# EasyEDA Pro project JLCEDA_AT_START_F457_V1.0.epro, board AT-START-F457 V1.0
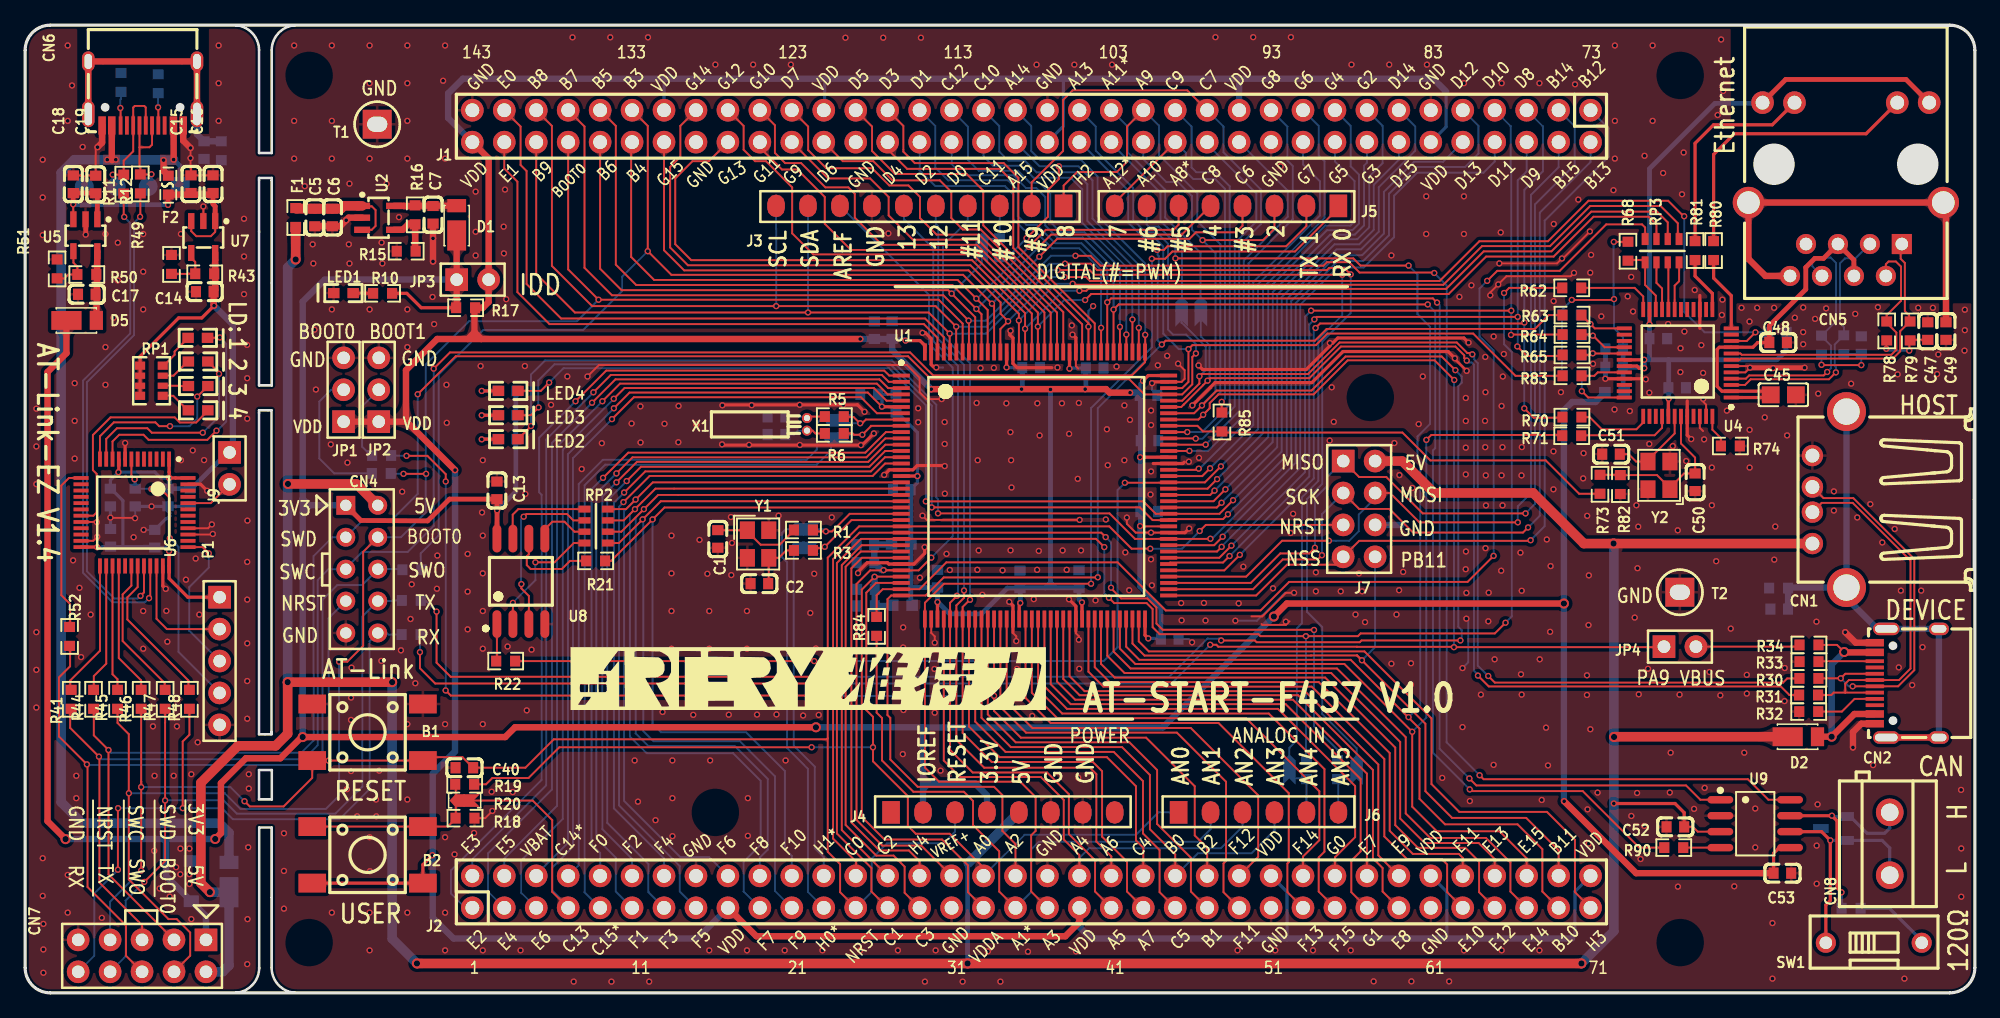
[diagram p5: board, top side]
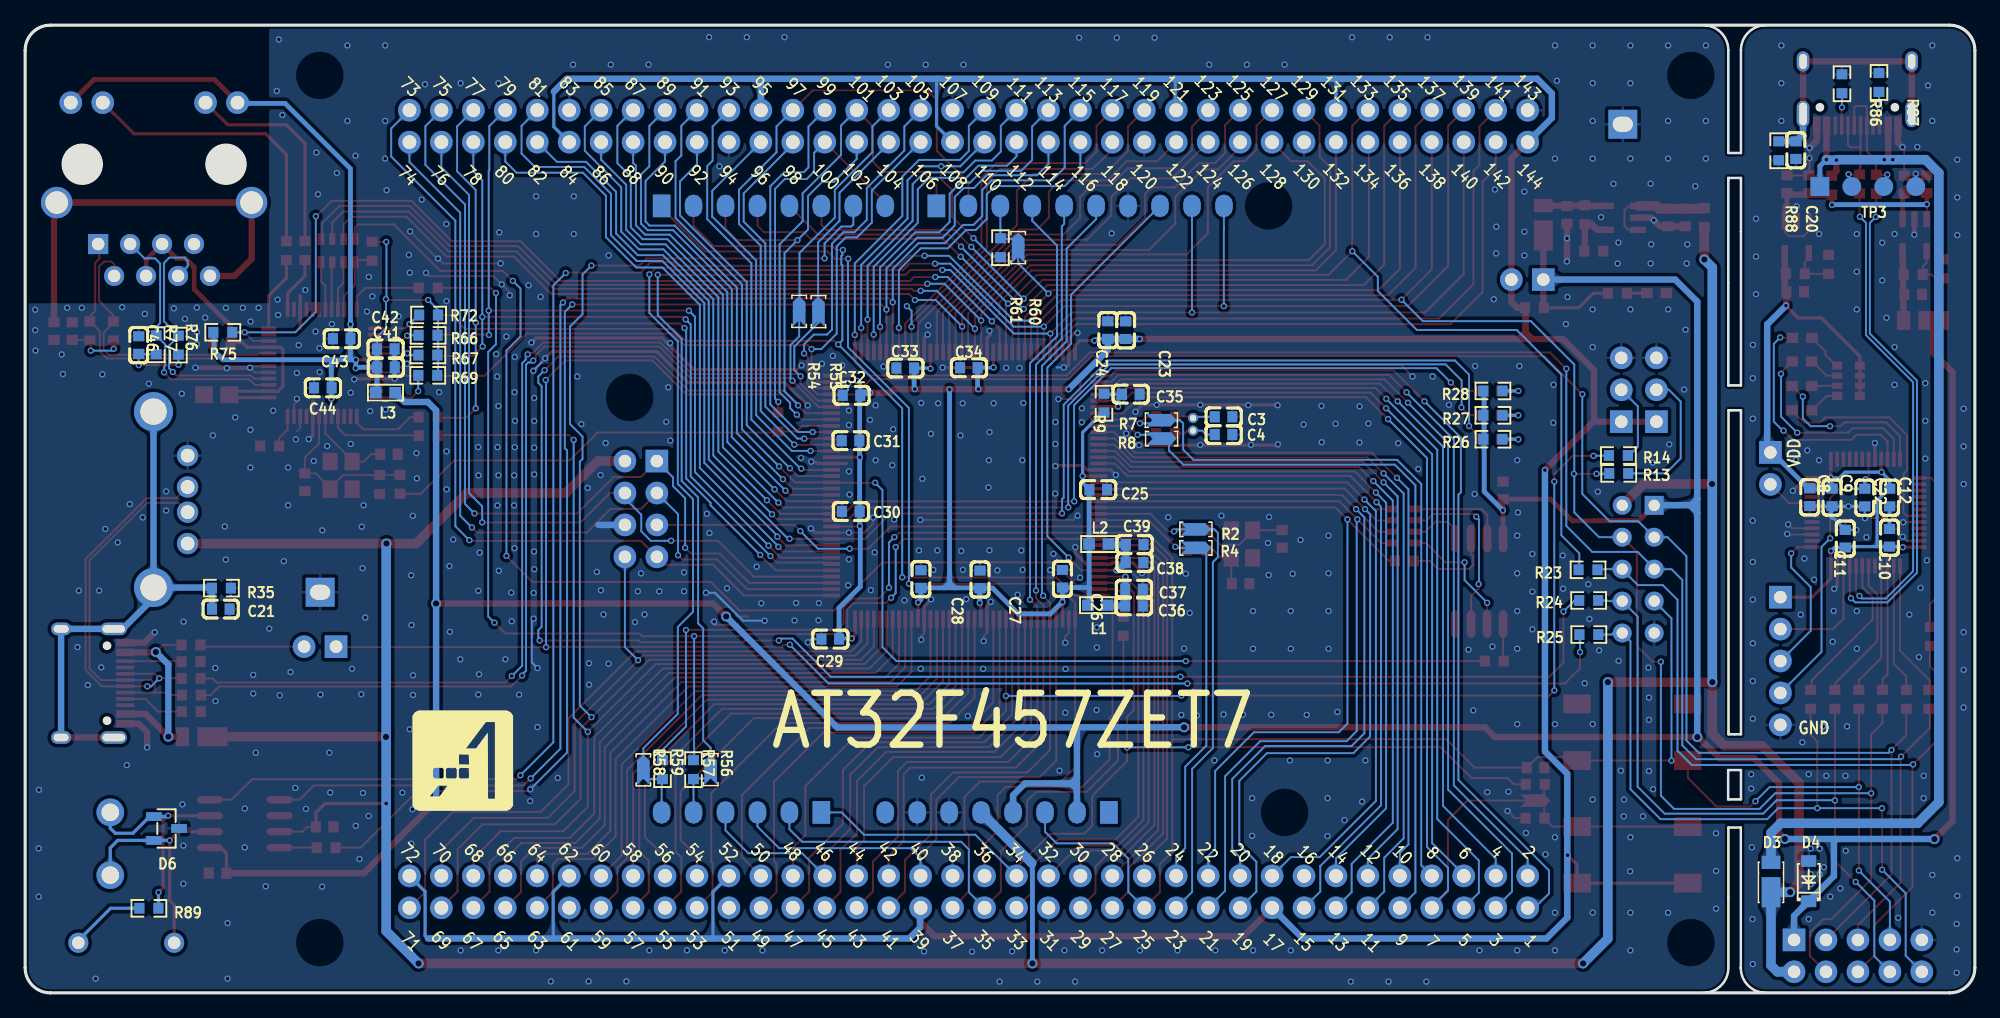
[diagram p6: board, bottom side, seen from below]

Outline 155 x 77 mm; copper layers: Top Layer, Bottom Layer. Coordinates in mm from the lower left corner of the outline.
Outline path: 16.6,77 arc(18.01,76.42) 18.6,75 18.6,66.83 19.6,66.83 19.6,75 arc(20.19,76.42) 21.6,77 ; 18.6,48.36 18.6,60.58 18.6,64.67 18.59,64.85 19.6,64.85 19.6,64.67 19.6,56.51 19.6,48.34 ; 18.6,48.36 18.62,48.34 ; 18.6,48.36 arc(18.6,48.34) 18.62,48.34 ; 18.62,48.34 19.59,48.34 ; 16.61,0 arc(18.02,0.59) 18.61,2 18.61,13.16 19.59,13.16 19.59,2 arc(20.18,0.59) 21.59,0 ; 19.59,48.34 19.6,48.34 ; 19.59,48.34 arc(19.6,48.34) 19.6,48.34 ; 0,75 0,2 arc(0.59,0.59) 2,0 153,0 arc(154.41,0.59) 155,2 155,75 arc(154.41,76.41) 153,77 2,77 arc(0.59,76.41) 0,75 ; 18.59,46.36 18.59,20.57 19.58,20.57 19.58,46.36 18.59,46.36 ; 18.59,17.73 18.59,15.39 19.61,15.39 19.61,17.73 18.59,17.73
Stack: Top Layer 0.035mm / Dielectric1 1.51mm FR4 er 4.5 / Bottom Layer 0.035mm

## Design rules (mm)
template: 自定义配置
spacing copperThickness1oz (default): track to track 0.152, other pairs 0.152 to 0.3
track width copperThickness1oz (default): min 0.152, default 0.152, max 2.54
differential pair differentialPair (default): width min 0.127, default 0.254, max 2.54; gap min 0.152, default 0.152
via viaSize (default): diameter min 0.5, default 0.5, max 0.8; hole min 0.3, default 0.3, max 0.5

## Placement (name value [footprint] x y rotation side)
B1  贴片按键6*6*5 黑色  [SW-SMD_4P-L6.0-W6.0-P4.50-LS9.0]  27.22 20.74 180 top
B2  贴片按键6*6*5 红色  [SW-SMD_4P-L6.0-W6.0-P4.50-LS9.0]  27.22 10.98 180 top
C1  15pF  [C0603]  55.07 36.12 90 top
C2  15pF  [C0603]  58.37 32.56 0 top
C3  18pF  [C0603]  59.73 45.84 0 bottom
C4  18pF  [C0603]  59.73 44.42 0 bottom
C5  10uF  [C0603]  23.03 61.7 270 top
C6  100nF  [C0603]  24.43 61.7 270 top
C7  10uF  [C0603]  32.43 61.91 270 top
C8  4.7uF  [C0603]  13.13 39.44 90 bottom
C9  100nF  [C0603]  11.35 39.42 90 bottom
C10  100nF  [C0603]  6.79 36.21 270 bottom
C11  100nF  [C0603]  10.3 36.14 270 bottom
C12  100nF  [C0603]  6.78 39.41 90 bottom
C13  100nF  [C0603]  37.51 39.99 90 top
C14  10uF  [C0603]  14.28 55.79 0 top
C15  10uF  [C0603]  13.18 64.35 270 top
C16  100nF  [C0603]  14.93 64.35 270 top
C17  10uF  [C0603]  4.9 55.59 0 top
C18  10uF  [C0603]  3.83 64.34 270 top
C19  100nF  [C0603]  5.61 64.32 270 top
C20  100nF  [C0603]  14.22 67.06 90 bottom
C21  100nF  [C0603]  139.45 30.54 180 bottom
C22  100nF  [C0603]  8.75 39.41 90 bottom
C23  4.7uF  [C0603]  67.51 52.73 90 bottom
C24  100nF  [C0603]  68.93 52.74 90 bottom
C25  100nF  [C0603]  69.69 40.04 180 bottom
C26  100nF  [C0603]  72.53 32.95 90 bottom
C27  100nF  [C0603]  79.09 32.9 90 bottom
C28  100nF  [C0603]  83.79 32.93 90 bottom
C29  100nF  [C0603]  90.99 28.15 0 bottom
C30  100nF  [C0603]  89.36 38.3 0 bottom
C31  100nF  [C0603]  89.38 43.94 0 bottom
C32  100nF  [C0603]  89.31 47.55 0 bottom
C33  100nF  [C0603]  85.03 49.72 0 bottom
C34  100nF  [C0603]  79.98 49.74 0 bottom
C35  100nF  [C0603]  67.1 47.63 180 bottom
C36  1uF  [C0603]  66.84 30.79 180 bottom
C37  100nF  [C0603]  66.84 32.11 180 bottom
C38  100nF  [C0603]  66.8 34.24 180 bottom
C39  1uF  [C0603]  66.79 35.67 180 bottom
C40  100nF  [C0603]  34.92 17.92 180 top
C41  10uF  [C0603]  126.32 49.78 180 bottom
C42  100nF  [C0603]  126.33 51.24 180 bottom
C43  100nF  [C0603]  129.84 52.05 0 bottom
C44  100nF  [C0603]  131.33 48.14 0 bottom
C45  47uF  [C0805]  139.77 47.59 180 top
C46  100nF  [C0603]  145.97 51.55 90 bottom
C47  100nF  [C0603]  151.26 52.66 90 top
C48  100nF  [C0603]  139.36 51.75 180 top
C49  100nF  [C0603]  152.71 52.66 90 top
C50  15pF  [C0603]  132.76 40.63 270 top
C51  15pF  [C0603]  126.08 42.86 180 top
C52  100nF  [C0603]  131.19 13.21 0 top
C53  100nF  [C0603]  139.7 9.53 180 top
CN1  JTJ-USB-AF-08  [USB-A-TH__USB-AF-90]  143.44 39.25 90 top
CN2  -  [USB-C-SMD_TYPEC-304-BCP16]  149.59 24.64 90 top
CN4  CON10A_0  [HDR2X5#2]  25.49 38.8 270 top
CN5  RJ45(TRJ201)  [RJ45-TH_HR911105A]  144.75 63.94 180 top
CN6  -  [USB-C-SMD_TYPEC-304-BCP16]  9.34 71.57 180 top
CN7  CON10  [HDR2X5]  14.37 4.22 180 top
CN8  KF301-5.0-2P  [CONN-TH_P5.00_KF301-5.0-2P]  148.23 11.87 90 top
D1  DFLS130L-7  [POWERDI-123_L2.8-W1.8-LS3.7-RD]  34.31 61.45 90 top
D2  DFLS130L-7  [POWERDI-123_L2.8-W1.8-LS3.7-RD]  141.3 20.38 0 top
D3  DFLS130L-7  [POWERDI-123_L2.8-W1.8-LS3.7-RD]  16.21 9.19 90 bottom
D4  SMF3.3A  [SOD-123FL_L2.8-W1.8-LS3.8-RD]  13.21 8.89 90 bottom
D5  DFLS130L-7  [POWERDI-123_L2.8-W1.8-LS3.7-RD]  4.47 53.5 0 top
D6  PESD2CANFD24V-TR  [SOT-23-3_L2.9-W1.3-P1.90-LS2.4-BR]  143.76 13.08 0 bottom
F1  SMD0603B050TF  [R0603]  21.51 61.7 90 top
F2  BSMD0603-050-6V  [F0603]  11.38 64.27 270 top
J1  HDR 2X36  [HDR_2.54_2X36]  80 68.96 180 top
J2  HDR 2X36  [HDR_2.54_2X36]  80 8.04 0 top
J3  CON10  [FEMALE HEADER 1X10]  71.13 62.62 0 top
J4  CON8  [FEMALE HEADER 1X8]  77.73 14.36 0 top
J5  CON8  [FEMALE HEADER 1X8]  95.51 62.62 180 top
J6  CON6  [FEMALE HEADER 1X6]  98.05 14.36 0 top
J7  Header 4X2  [HDR2X4]  104.78 42.31 270 top
J9  1X2P_2.54M  [HDR1X2]  16.25 43 270 top
JP1  Jumper 1x3P  [HEADER 1X3]  25.31 45.45 90 top
JP2  Jumper 1x3P  [HEADER 1X3]  28.11 45.45 90 top
JP3  Jumper 1x2P  [HEADER 1X2]  34.31 56.75 0 top
JP4  Jumper 1x2P  [HEADER 1X2]  130.28 27.55 0 top
L1  0.5A,600Ω@100Mhz  [0603_L]  69.74 30.84 180 bottom
L2  0.5A,600Ω@100Mhz  [0603_L]  69.65 35.71 180 bottom
L3  0.5A,600Ω@100Mhz  [0603_L]  126.36 47.76 0 bottom
LD1  RED  [LED0603]  12.95 52.12 0 top
LD2  GREEN  [LED0603]  12.98 50.23 0 top
LD3  BLUE  [LED0603]  12.98 48.28 0 top
LD4  YELLOW  [LED0603]  12.98 46.35 0 top
LED1  RED  [LED0603]  26.08 55.69 180 top
LED2  RED  [LED0603]  37.63 44.05 0 top
LED3  YELLOW  [LED0603]  37.63 45.96 0 top
LED4  GREEN  [LED0603]  37.63 47.9 0 top
P1  Header 5  [HDR1X5]  15.46 31.48 270 top
R1  0Ω  [R0603]  61.87 36.83 0 top
R2  NC  [SB-PAD]  61.93 36.88 0 bottom
R3  0Ω  [R0603]  61.87 35.2 0 top
R4  NC  [SB-PAD]  61.93 35.41 0 bottom
R5  0Ω  [R0603]  64.33 45.86 0 top
R6  0Ω  [R0603]  64.33 44.52 0 top
R7  NC  [SB-PAD]  64.67 45.57 0 bottom
R8  NC  [SB-PAD]  64.65 44.1 0 bottom
R9  0Ω  [R0603]  69.23 46.92 270 bottom
R10  1kΩ  [R0603]  28.41 55.66 180 top
R11  0Ω  [R0603]  7.84 64.35 270 top
R12  0Ω  [R0603]  9.16 64.37 270 top
R13  10kΩ  [R0603]  28.31 41.33 0 bottom
R14  10kΩ  [R0603]  28.34 42.76 0 bottom
R15  15kΩ  [R0603]  30.29 59.01 180 top
R16  51kΩ  [R0603]  31 61.91 90 top
R17  0Ω  [R0603]  35.02 54.52 0 top
R18  100kΩ  [R0603]  34.97 13.9 180 top
R19  0Ω  [R0603]  34.94 16.59 0 top
R20  NC  [SB-PAD]  34.94 15.3 0 top
R21  33Ω  [R0603]  45.35 34.37 180 top
R22  33Ω  [R0603]  38.2 26.4 180 top
R23  470Ω  [R0603]  30.75 33.66 0 bottom
R24  470Ω  [R0603]  30.7 31.23 0 bottom
R25  470Ω  [R0603]  30.69 28.51 0 bottom
R26  1kΩ  [R0603]  38.31 44.05 180 bottom
R27  1kΩ  [R0603]  38.31 45.96 180 bottom
R28  1kΩ  [R0603]  38.31 47.9 180 bottom
R30  0Ω  [R0603]  141.81 25.02 0 top
R31  0Ω  [R0603]  141.78 23.7 0 top
R32  5.1kΩ  [R0603]  141.79 22.38 0 top
R33  5.1kΩ  [R0603]  141.81 26.36 0 top
R34  10kΩ  [R0603]  141.81 27.69 0 top
R35  1MΩ  [R0603]  139.4 32.21 0 bottom
R41  33Ω  [R0603]  3.66 23.36 270 top
R43  47kΩ  [R0603]  14.27 57.22 180 top
R44  33Ω  [R0603]  5.44 23.36 270 top
R45  33Ω  [R0603]  7.34 23.36 270 top
R46  33Ω  [R0603]  9.22 23.36 270 top
R47  33Ω  [R0603]  11.13 23.36 270 top
R48  33Ω  [R0603]  13.06 23.36 270 top
R49  15kΩ  [R0603]  11.63 57.96 90 top
R50  51kΩ  [R0603]  4.9 57.16 180 top
R51  15kΩ  [R0603]  2.54 57.61 90 top
R52  33Ω  [R0603]  3.53 28.36 270 top
R54  NC  [SB-PAD]  93.47 54.23 270 bottom
R55  NC  [SB-PAD]  91.93 54.21 270 bottom
R56  NC  [SB-PAD]  100.5 17.76 270 bottom
R57  0Ω  [R0603]  101.87 17.76 270 bottom
R58  NC  [SB-PAD]  105.85 17.74 270 bottom
R59  0Ω  [R0603]  104.33 17.76 270 bottom
R60  NC  [SB-PAD]  76.06 59.3 270 bottom
R61  0Ω  [R0603]  77.46 59.29 90 bottom
R62  33Ω  [R0603]  122.95 56.09 0 top
R63  33Ω  [R0603]  122.97 53.93 0 top
R64  33Ω  [R0603]  122.97 52.38 0 top
R65  33Ω  [R0603]  122.97 50.76 0 top
R66  4.7kΩ  [R0603]  122.97 52.32 0 bottom
R67  4.7kΩ  [R0603]  122.98 50.75 0 bottom
R68  4.7kΩ  [R0603]  127.42 59.01 270 top
R69  4.7kΩ  [R0603]  122.99 49.14 0 bottom
R70  33Ω  [R0603]  122.97 45.81 0 top
R71  33Ω  [R0603]  122.95 44.33 0 top
R72  1.5kΩ  [R0603]  122.92 53.94 180 bottom
R73  33Ω(NC)  [R0603]  125.2 40.47 90 top
R74  6.8kΩ  [R0603]  135.56 43.52 180 top
R75  4.7kΩ  [R0603]  139.29 52.56 0 bottom
R76  49.9Ω  [R0603]  142.81 51.55 90 bottom
R77  49.9Ω  [R0603]  144.58 51.57 90 bottom
R78  49.9Ω  [R0603]  147.99 52.67 90 top
R79  49.9Ω  [R0603]  149.85 52.67 90 top
R80  470Ω  [R0603]  134.23 59.06 270 top
R81  470Ω  [R0603]  132.76 59.06 270 top
R82  100kΩ(NC)  [R0603]  126.82 40.45 270 top
R83  33Ω  [R0603]  122.97 49.1 0 top
R84  0Ω  [R0603]  67.69 29.16 90 top
R85  0Ω  [R0603]  95.14 45.42 270 top
R86  5.1kΩ  [R0603]  10.57 72.34 90 bottom
R87  5.1kΩ  [R0603]  7.62 72.44 90 bottom
R88  1MΩ  [R0603]  15.6 67 270 bottom
R89  120Ω  [R0603]  145.16 6.73 180 bottom
R90  330Ω  [R0603]  131.06 11.56 0 top
RP1  1kΩ  [RES-ARRAY-SMD_0603-8P-L3.2-W1.6-BL]  10.04 48.71 270 top
RP2  33R  [0603*4,8P4R]  46.32 35.79 90 top
RP3  33R  [0603*4,8P4R]  131.49 59.98 180 top
SW1  DSWB01LHGET  [SW-TH_DSWB01LHGET]  146.96 3.99 90 top
T1  TESTPOINT TP-5006  [TESTHOOK]  27.99 69.12 0 top
T2  TESTPOINT TP-5006  [TESTHOOK]  131.55 31.88 0 top
TP3  1X4P_2.54F  [HDR1X4 - TOP]  12.32 64.16 0 bottom
U1  AT32F457ZET7  [LQFP144_20*20]  80.28 40.37 0 top
U2  RT9080N-08GJ5  [SOT-23-5]  28.44 60.08 0 top
U4  DM9162EP  [LQFP48_7*7]  131.38 50.12 180 top
U5  RT9080N-08GJ5  [SOT-23-5]  3.2 59.9 270 top
U6  AT32F403ACCT7  [LQFP48 - 2]  11.45 42.47 270 top
U7  RT9080N-08GJ5  [SOT-23-5]  12.57 59.76 270 top
U8  EN25QH128A-104HIP  [SOIC-8_208MIL]  39.41 32.75 0 top
U9  MCP2562FD-E/SN  [SOIC-8_L4.9-W3.9-P1.27-LS6.0-BL]  137.54 13.46 270 top
X1  32.768kHz  [OSC-TH_BD2.0-P0.70-D0.3]  62.15 45.24 0 top
Y1  8MHz  [CRYSTAL-SMD_4P-L3.2-W2.5-BL]  58.27 35.71 270 top
Y2  25MHz  [OSC-SMD_4P-L3.2-W2.5-BL]  129.89 41.18 90 top

## Footprints (pads in the part's own frame, mm; a bottom-side part is the same pattern mirrored in y, then rotated)
0603*4,8P4R
  rect 0.55x0.95 smd: 1(0,0) 4(2.7,0) 5(2.7,1.85) 8(0,1.85)
  rect 0.5x0.95 smd: 2(0.9,0) 3(1.8,0) 6(1.8,1.85) 7(0.9,1.85)
0603_L
  rect 0.93x0.9 smd: 1(-0.77,0) 2(0.77,0)
C0603
  rect 0.8x0.9 smd: 1(-0.7,0) 2(0.7,0)
C0805
  rect 1.41x1.35 smd: 1(-1,0) 2(1,0)
CONN-TH_P5.00_KF301-5.0-2P
  round 2.2 hole 1.4: 1(-2.5,0) 2(2.5,0)
CRYSTAL-SMD_4P-L3.2-W2.5-BL
  rect 1.4x1.2 smd: 1(-1.1,-0.85) 2(1.1,-0.85) 3(1.1,0.85) 4(-1.1,0.85)
F0603
  rect 0.806x0.864 smd: 1(-0.753,0) 2(0.753,0)
FEMALE HEADER 1X6
  custom 1.4x1.8 hole 0.7x1: 1(-6.35,0) 2(-3.81,0) 3(-1.27,0) 4(1.27,0) 5(3.81,0) 6(6.35,0)
FEMALE HEADER 1X8
  custom 1.4x1.8 hole 0.7x1: 1(-8.89,0) 2(-6.35,0) 3(-3.81,0) 4(-1.27,0) 5(1.27,0) 6(3.81,0) 7(6.35,0) 8(8.89,0)
FEMALE HEADER 1X10
  custom 1.4x1.8 hole 0.7x1: 1(11.43,0) 2(8.89,0) 3(6.35,0) 4(3.81,0) 5(1.27,0) 6(-1.27,0) 7(-3.81,0) 8(-6.35,0) 9(-8.89,0) 10(-11.43,0)
HDR1X2
  rect 1.8x1.8 hole 1: 1(0,0)
  round 1.8 hole 1: 2(2.54,0)
HDR1X4 - TOP
  rect 1.5x1.5 smd: 1(0,0)
  round 1.5 smd: 2(-2.54,0) 3(-5.08,0) 4(-7.62,0)
HDR1X5
  rect 1.8x1.8 hole 1: 1(0,0)
  round 1.8 hole 1: 2(2.54,0) 3(5.08,0) 4(7.62,0) 5(10.16,0)
HDR2X4
  rect 1.8x1.8 hole 1.005x1: 1(0,0)
  round 1.8 hole 1.005x1: 2(0,2.54) 3(2.54,0) 4(2.54,2.54) 5(5.08,0) 6(5.08,2.54) 7(7.62,0) 8(7.62,2.54)
HDR2X5
  rect 1.8x1.8 hole 1: 1(0,0)
  round 1.8 hole 1: 2(0,2.54) 3(2.54,0) 4(2.54,2.54) 5(5.08,0) 6(5.08,2.54) 7(7.62,0) 8(7.62,2.54) 9(10.16,0) 10(10.16,2.54)
HDR2X5#2
  rect 1.5x1.5 hole 0.9: 1(0,0)
  round 1.5 hole 0.9: 2(0,2.54) 3(2.54,0) 4(2.54,2.54) 5(5.08,0) 6(5.08,2.54) 7(7.62,0) 8(7.62,2.54) 9(10.16,0) 10(10.16,2.54)
HDR_2.54_2X36
  round 1.8 hole 1.1: 1(-44.45,-1.27) 2(-44.45,1.27) 3(-41.91,-1.27) 4(-41.91,1.27) 5(-39.37,-1.27) 6(-39.37,1.27) 7(-36.83,-1.27) 8(-36.83,1.27) 9(-34.29,-1.27) 10(-34.29,1.27) 11(-31.75,-1.27) 12(-31.75,1.27) 13(-29.21,-1.27) 14(-29.21,1.27) 15(-26.67,-1.27) 16(-26.67,1.27) 17(-24.13,-1.27) 18(-24.13,1.27) 19(-21.59,-1.27) 20(-21.59,1.27) 21(-19.05,-1.27) 22(-19.05,1.27) 23(-16.51,-1.27) 24(-16.51,1.27) 25(-13.97,-1.27) 26(-13.97,1.27) 27(-11.43,-1.27) 28(-11.43,1.27) 29(-8.89,-1.27) 30(-8.89,1.27) 31(-6.35,-1.27) 32(-6.35,1.27) 33(-3.81,-1.27) 34(-3.81,1.27) 35(-1.27,-1.27) 36(-1.27,1.27) 37(1.27,-1.27) 38(1.27,1.27) 39(3.81,-1.27) 40(3.81,1.27) 41(6.35,-1.27) 42(6.35,1.27) 43(8.89,-1.27) 44(8.89,1.27) 45(11.43,-1.27) 46(11.43,1.27) 47(13.97,-1.27) 48(13.97,1.27) 49(16.51,-1.27) 50(16.51,1.27) 51(19.05,-1.27) 52(19.05,1.27) 53(21.59,-1.27) 54(21.59,1.27) 55(24.13,-1.27) 56(24.13,1.27) 57(26.67,-1.27) 58(26.67,1.27) 59(29.21,-1.27) 60(29.21,1.27) 61(31.75,-1.27) 62(31.75,1.27) 63(34.29,-1.27) 64(34.29,1.27) 65(36.83,-1.27) 66(36.83,1.27) 67(39.37,-1.27) 68(39.37,1.27) 69(41.91,-1.27) 70(41.91,1.27) 71(44.45,-1.27) 72(44.45,1.27)
HEADER 1X2
  rect 1.8x1.8 hole 1.005x1: 1(0,0)
  round 1.8 hole 1.005x1: 2(2.54,0)
HEADER 1X3
  rect 1.8x1.8 hole 1.005x1: 1(0,0)
  round 1.8 hole 1.005x1: 2(2.54,0) 3(5.08,0)
LED0603
  rect 0.914x0.813 smd: 1(-0.001,0.005) 2(1.548,0.005)
LQFP48 - 2
  rect 1.2x0.3 smd: 1(0,0) 2(0,-0.5) 3(0,-1) 4(0,-1.5) 5(0,-2) 6(0,-2.5) 7(0,-3) 8(0,-3.5) 9(0,-4) 10(0,-4.5) 11(0,-5) 12(0,-5.5) 25(8.5,-5.5) 26(8.5,-5) 27(8.5,-4.5) 28(8.5,-4) 29(8.5,-3.5) 30(8.5,-3) 31(8.5,-2.5) 32(8.5,-2) 33(8.5,-1.5) 34(8.5,-1) 35(8.5,-0.5) 36(8.5,0)
  rect 0.3x1.2 smd: 13(1.5,-7) 14(2,-7) 15(2.5,-7) 16(3,-7) 17(3.5,-7) 18(4,-7) 19(4.5,-7) 20(5,-7) 21(5.5,-7) 22(6,-7) 23(6.5,-7) 24(7,-7) 37(7,1.5) 38(6.5,1.5) 39(6,1.5) 40(5.5,1.5) 41(5,1.5) 42(4.5,1.5) 43(4,1.5) 44(3.5,1.5) 45(3,1.5) 46(2.5,1.5) 47(2,1.5) 48(1.5,1.5)
LQFP48_7*7
  rect 1.2x0.3 smd: 1(-4.25,2.75) 2(-4.25,2.25) 3(-4.25,1.75) 4(-4.25,1.25) 5(-4.25,0.75) 6(-4.25,0.25) 7(-4.25,-0.25) 8(-4.25,-0.75) 9(-4.25,-1.25) 10(-4.25,-1.75) 11(-4.25,-2.25) 12(-4.25,-2.75) 25(4.25,-2.75) 26(4.25,-2.25) 27(4.25,-1.75) 28(4.25,-1.25) 29(4.25,-0.75) 30(4.25,-0.25) 31(4.25,0.25) 32(4.25,0.75) 33(4.25,1.25) 34(4.25,1.75) 35(4.25,2.25) 36(4.25,2.75)
  rect 0.3x1.2 smd: 13(-2.75,-4.25) 14(-2.25,-4.25) 15(-1.75,-4.25) 16(-1.25,-4.25) 17(-0.75,-4.25) 18(-0.25,-4.25) 19(0.25,-4.25) 20(0.75,-4.25) 21(1.25,-4.25) 22(1.75,-4.25) 23(2.25,-4.25) 24(2.75,-4.25) 37(2.75,4.25) 38(2.25,4.25) 39(1.75,4.25) 40(1.25,4.25) 41(0.75,4.25) 42(0.25,4.25) 43(-0.25,4.25) 44(-0.75,4.25) 45(-1.25,4.25) 46(-1.75,4.25) 47(-2.25,4.25) 48(-2.75,4.25)
LQFP144_20*20
  rect 1.35x0.3 smd: 1(-10.625,8.75) 2(-10.625,8.25) 3(-10.625,7.75) 4(-10.625,7.25) 5(-10.625,6.75) 6(-10.625,6.25) 7(-10.625,5.75) 8(-10.625,5.25) 9(-10.625,4.75) 10(-10.625,4.25) 11(-10.625,3.75) 12(-10.625,3.25) 13(-10.625,2.75) 14(-10.625,2.25) 15(-10.625,1.75) 16(-10.625,1.25) 17(-10.625,0.75) 18(-10.625,0.25) 19(-10.625,-0.25) 20(-10.625,-0.75) 21(-10.625,-1.25) 22(-10.625,-1.75) 23(-10.625,-2.25) 24(-10.625,-2.75) 25(-10.625,-3.25) 26(-10.625,-3.75) 27(-10.625,-4.25) 28(-10.625,-4.75) 29(-10.625,-5.25) 30(-10.625,-5.75) 31(-10.625,-6.25) 32(-10.625,-6.75) 33(-10.625,-7.25) 34(-10.625,-7.75) 35(-10.625,-8.25) 36(-10.625,-8.75) 73(10.625,-8.75) 74(10.625,-8.25) 75(10.625,-7.75) 76(10.625,-7.25) 77(10.625,-6.75) 78(10.625,-6.25) 79(10.625,-5.75) 80(10.625,-5.25) 81(10.625,-4.75) 82(10.625,-4.25) 83(10.625,-3.75) 84(10.625,-3.25) 85(10.625,-2.75) 86(10.625,-2.25) 87(10.625,-1.75) 88(10.625,-1.25) 89(10.625,-0.75) 90(10.625,-0.25) 91(10.625,0.25) 92(10.625,0.75) 93(10.625,1.25) 94(10.625,1.75) 95(10.625,2.25) 96(10.625,2.75) 97(10.625,3.25) 98(10.625,3.75) 99(10.625,4.25) 100(10.625,4.75) 101(10.625,5.25) 102(10.625,5.75) 103(10.625,6.25) 104(10.625,6.75) 105(10.625,7.25) 106(10.625,7.75) 107(10.625,8.25) 108(10.625,8.75)
  rect 0.3x1.35 smd: 37(-8.75,-10.625) 38(-8.25,-10.625) 39(-7.75,-10.625) 40(-7.25,-10.625) 41(-6.75,-10.625) 42(-6.25,-10.625) 43(-5.75,-10.625) 44(-5.25,-10.625) 45(-4.75,-10.625) 46(-4.25,-10.625) 47(-3.75,-10.625) 48(-3.25,-10.625) 49(-2.75,-10.625) 50(-2.25,-10.625) 51(-1.75,-10.625) 52(-1.25,-10.625) 53(-0.75,-10.625) 54(-0.25,-10.625) 55(0.25,-10.625) 56(0.75,-10.625) 57(1.25,-10.625) 58(1.75,-10.625) 59(2.25,-10.625) 60(2.75,-10.625) 61(3.25,-10.625) 62(3.75,-10.625) 63(4.25,-10.625) 64(4.75,-10.625) 65(5.25,-10.625) 66(5.75,-10.625) 67(6.25,-10.625) 68(6.75,-10.625) 69(7.25,-10.625) 70(7.75,-10.625) 71(8.25,-10.625) 72(8.75,-10.625) 109(8.75,10.625) 110(8.25,10.625) 111(7.75,10.625) 112(7.25,10.625) 113(6.75,10.625) 114(6.25,10.625) 115(5.75,10.625) 116(5.25,10.625) 117(4.75,10.625) 118(4.25,10.625) 119(3.75,10.625) 120(3.25,10.625) 121(2.75,10.625) 122(2.25,10.625) 123(1.75,10.625) 124(1.25,10.625) 125(0.75,10.625) 126(0.25,10.625) 127(-0.25,10.625) 128(-0.75,10.625) 129(-1.25,10.625) 130(-1.75,10.625) 131(-2.25,10.625) 132(-2.75,10.625) 133(-3.25,10.625) 134(-3.75,10.625) 135(-4.25,10.625) 136(-4.75,10.625) 137(-5.25,10.625) 138(-5.75,10.625) 139(-6.25,10.625) 140(-6.75,10.625) 141(-7.25,10.625) 142(-7.75,10.625) 143(-8.25,10.625) 144(-8.75,10.625)
OSC-SMD_4P-L3.2-W2.5-BL
  rect 1.4x1.2 smd: 1(-1.1,-0.875) 2(1.1,-0.875) 3(1.1,0.875) 4(-1.1,0.875)
OSC-TH_BD2.0-P0.70-D0.3
  round 0.8 hole 0.5: 1(0,0.5) 2(0,-0.5)
POWERDI-123_L2.8-W1.8-LS3.7-RD
  rect 2.4x1.5 smd: 1(-1.188,0)
  rect 1.05x1.5 smd: 2(1.188,0)
R0603
  rect 0.806x0.864 smd: 1(-0.753,0) 2(0.753,0)
RES-ARRAY-SMD_0603-8P-L3.2-W1.6-BL
  rect 0.65x0.8 smd: 1(-1.2,-0.9) 4(1.2,-0.9) 5(1.2,0.9) 8(-1.2,0.9)
  rect 0.5x0.8 smd: 2(-0.4,-0.9) 3(0.4,-0.9) 6(0.4,0.9) 7(-0.4,0.9)
RJ45-TH_HR911105A
  rect 1.6x1.6 hole 1: 1(-4.45,4.355)
  round 1.6 hole 1: 2(-3.18,6.895) 3(-1.91,4.355) 4(-0.64,6.895) 5(0.63,4.355) 6(1.9,6.895) 7(3.17,4.355) 8(4.44,6.895)
  round 1.8 hole 1.1: 9(-6.625,-6.895) 10(-4.085,-6.895) 11(4.085,-6.895) 12(6.625,-6.895)
  round 2.5 hole 1.8: SH1(-7.745,1.055) SH2(7.745,1.055)
SB-PAD
  custom 1.226x1 smd: 1(-0.587,0)
  custom 1.319x1 smd: 2(0.54,0)
SOD-123FL_L2.8-W1.8-LS3.8-RD
  rect 0.93x1.2 smd: 1(-1.6,0) 2(1.6,0)
SOIC-8_208MIL
  oval 0.7x2.2 smd: 1(-1.905,-3.4) 2(-0.635,-3.4) 3(0.635,-3.4) 4(1.905,-3.4) 5(1.905,3.4) 6(0.635,3.4) 7(-0.635,3.4) 8(-1.905,3.4)
SOIC-8_L4.9-W3.9-P1.27-LS6.0-BL
  oval 0.588x2.045 smd: 1(-1.905,-2.772) 2(-0.635,-2.772) 3(0.635,-2.772) 4(1.905,-2.772) 5(1.905,2.772) 6(0.635,2.772) 7(-0.635,2.772) 8(-1.905,2.772)
SOT-23-3_L2.9-W1.3-P1.90-LS2.4-BR
  rect 1.25x0.7 smd: 1(1,-0.95) 2(1,0.95) 3(-1,0)
SOT-23-5
  rect 1.27x0.508 smd: 1(-1.651,2.54) 2(-1.651,1.6) 3(-1.651,0.635) 4(0.889,0.635) 5(0.889,2.54)
SW-SMD_4P-L6.0-W6.0-P4.50-LS9.0
  rect 2.2x1.5 smd: 1(-4.4,2.25) 2(-4.4,-2.25) 3(4.4,2.25) 4(4.4,-2.25)
SW-TH_DSWB01LHGET
  round 1.6 hole 1: 1(0,3.81) 2(0,-3.81)
TESTHOOK
  rect 2.3x2.3 hole 1.6x1.2: 1(0,0)
USB-A-TH__USB-AF-90
  round 1.7 hole 1.1: 1(-3.5,1.355) 2(-1,1.355) 3(1,1.355) 4(3.5,1.355)
  round 3.1 hole 2.1: SH1(7,-1.355) SH2(-7,-1.355)
USB-C-SMD_TYPEC-304-BCP16
  oval 1.001x2.1 hole 0.6x1.801: 13(-4.321,1.633) 14(4.321,1.633)
  oval 1.001x1.6 hole 0.6x1.199: 15(-4.321,-2.547) 16(4.321,-2.547)
  rect 0.6x1.45 smd: A1B12(-3.226,2.547) A4B9(-2.451,2.547) B1A12(3.22,2.547) B4A9(2.451,2.547)
  rect 0.299x1.45 smd: A5(-1.25,2.547) A6(-0.249,2.547) A7(0.249,2.547) A8(1.25,2.547) B5(1.75,2.547) B6(0.75,2.547) B7(-0.75,2.547) B8(-1.75,2.547)

## Nets
As in the schematic.

Pads without a net: CN2 A8 B8; CN5 7; CN6 A8 B8; J4 1 8; U4 11 14 16 17 18 26 27 34 35 38 39 45; U6 2 3 4 5 6 14 15 16 17 18 21 22 29 38 41 42 43 45 46

## Via types
v1: diameter 0.5, hole 0.3, Top Layer to Bottom Layer, 425 vias
v2: diameter 0.5, hole 0.299, Top Layer to Bottom Layer, 489 vias
v3: diameter 0.8, hole 0.5, Top Layer to Bottom Layer, 18 vias

## Routing (per net, layer and track width the routed paths; a pad name or vN(x,y) marks a point on that pad's centre or on a via; arc(x,y) is an arc through that point)
3V3: length 343.3
  Top Layer w0.254: C53.2 139,11.11 139.45,11.56 140.31,11.56 ; 29.11,55.66 30.34,55.66 31.49,54.52 34.32,54.52
  Top Layer w0.381: U8.8 v1(37.52,38.4) 37.51,38.41 37.51,39.29 33.73,39.29 32,37.56 26.69,37.59 25.49,38.8
  Top Layer w0.508: v3(122.33,30.98) 100.31,30.98 v3(99.27,29.95) ; C53.2 128.07,9.53 v1(122.35,15.25) ; v3(15.11,12.24) 15.56,12.7 15.56,16.68 17.55,18.67 20.29,18.67 21.98,20.35 v3(22.06,20.35) 38.17,20.35 38.95,21.13 v3(62.87,21.13) ; 3.28,53.11 3.79,53.62 ; 3.28,53.11 3.28,53.5 ; 3.28,53.11 3.28,50.9 1.78,49.4 1.78,13.67 v3(3.21,12.23) ; 34.32,54.52 34.3,54.53 34.3,60.26
  Bottom Layer w0.381: 39.01,47.9 39.01,39.89 v1(37.52,38.4)
  Bottom Layer w0.508: 22.55,38.81 22.06,39.3 ; 22.55,38.81 22.55,38.72 22.06,38.23 ; 22.55,38.81 25.49,38.8 ; 22.06,39.3 22.06,38.23 ; 22.06,39.3 22.06,55 23.82,56.75 34.3,56.75 ; 11,12.24 11.2,12.04 11.2,9.3 D4.1 14.37,6.12 CN7.1 ; 11,12.24 3.22,12.24 v3(3.21,12.23) ; 11,12.24 v3(15.11,12.24) ; 22.06,38.23 v3(22.06,20.35) ; 71.83,16.67 71.38,17.12 ; 71.83,16.67 71.38,16.21 ; 71.83,16.67 75.51,16.67 76.46,15.72 76.46,14.36 ; 71.38,17.12 71.38,16.21 ; 71.38,17.12 71.38,21.12 ; 71.38,16.21 71.38,14.36 ; v3(62.87,21.13) 71.37,21.13 71.38,21.12 ; v1(122.35,15.25) 122.33,15.27 122.33,30.98 ; 71.38,21.12 90.44,21.12 v3(99.27,29.95) ; L3.1 124.84,47.02 122.99,47.02 122.33,46.35 v3(122.33,30.98)
3V3_EMAC: length 88.7
  Top Layer w0.152: v1(126.32,55.2) 126.25,55.14 v1(122.96,55.14) ; 126.3,59.76 127.38,59.76 127.42,59.71
  Top Layer w0.254: 127.13,49.87 128.14,49.87 128.3,49.7 v1(128.72,49.7) ; v1(128.71,50.38) 127.14,50.38 127.13,50.37 ; 130.66,47.28 130.63,47.25 130.63,45.87 ; U4.23 v1(129.14,53.2)
  Top Layer w0.381: 138.12,70.84 139.96,72.68 149.53,72.68 151.37,70.84
  Bottom Layer w0.152: R69.1 122.17,49.21 122.17,53.9 ; v1(122.96,55.14) 122.17,54.35 R72.2 ; C42.1 127.03,52.17 126.32,52.89 v1(126.32,55.2) 126.28,55.24 126.28,59.73
  Bottom Layer w0.254: v1(129.14,53.2) 129.14,53.19
  Bottom Layer w0.381: 138.12,70.83 138.06,70.77 134.33,70.77 129.14,65.58 129.14,50.42 129.18,50.38 ; 128.71,49.71 128.65,49.78 127.03,49.78 ; 128.71,49.71 v1(128.71,50.38) 129.18,50.38 ; 128.71,49.71 v1(128.72,49.7) ; L3.2 127.03,47.86 127.03,49.78 ; 127.03,49.78 C41.1 ; 127.03,49.78 C42.1 ; 129.18,50.38 130.62,50.38 130.62,50.38 ; 139.98,52.56 139.98,51.1 139.26,50.38 130.62,50.38 ; 130.66,47.28 130.66,50.34 130.62,50.38
  vias: v1(126.3,59.76) v1(130.66,47.28)
5V: length 309
  Top Layer w0.152: C52.2 132.59,13.21 132.97,12.83 U9.3 ; v3(126.28,35.76) 126.27,35.75
  Top Layer w0.254: v1(126.3,15.07) 131.16,15.07 131.89,14.34 C52.2
  Top Layer w0.762: v3(31.15,2.34) v3(74.92,2.34) v3(123.72,2.34) ; D2.1 126.33,20.38 v3(126.32,20.36) ; v3(14.68,8.02) 13.97,8.73 13.97,16.71 16.92,19.66 19.91,19.66 20.87,20.62 v3(20.87,24.72) v3(29.18,24.72) ; v3(20.89,40.5) 26.33,40.5 28.03,38.8 ; CN1.1 123.91,35.75 119.89,39.78 112.01,39.78 109.47,42.32 107.32,42.32 ; 21.51,60.94 21.51,58.35
  Bottom Layer w0.381: 74.97,10.32 74.92,10.27 74.92,2.34 v3(74.92,2.34)
  Bottom Layer w0.762: v1(126.3,15.07) 126.3,35.74 v3(126.28,35.76) ; 126.3,15.07 126.3,4.92 v3(123.72,2.34) ; v3(14.68,8.02) 14.69,8.01 D3.1 16.21,2.18 15.7,1.68 CN7.2 ; 79,14.36 74.97,10.32 ; v3(21.5,58.35) 20.87,57.72 v3(20.87,24.72) ; v3(29.18,24.72) 29.18,4.31 v3(31.15,2.34)
AVDD18: length 28.6
  Top Layer w0.254: U4.2 134.9,47.87 134.51,48.26 134.51,51.2 134.69,51.37 U4.9 137.36,51.37 137.74,51.75 C48.2 ; 135.63,47.87 138.49,47.87 C45.2 138.56,47.37 U4.1
  Top Layer w0.381: C48.2 138.66,53.08 141.56,55.98 141.56,57.72 142.28,58.44 142.97,58.44 144.11,59.58 145.38,58.31 145.38,57.05
GND: length 273.6
  Top Layer w0.152: v2(72.86,47.25) 71.66,47.25 71.11,47.79 71.11,48.94 70.09,49.96 45.61,49.96 v2(44.7,49.05) ; 133.41,47.03 133.63,46.8 133.63,45.87 ; C18.1 5.59,65.04 C19.1 5.61,67.15 v1(5.75,67.29) ; v1(83.83,37.63) 71.67,37.63 v2(71.34,37.97) ; v1(100.88,31.84) 100.23,31.84 98.35,29.96 97.49,29.96 ; U1.83 v2(89.51,36.62) 88.29,36.62 87.59,37.32 v1(87.59,37.82) ; v1(13.15,67.23) v2(13.15,66.42) 13.15,65.64 13.18,65.6 13.18,65.05 14.93,65.05 ; U7.2 14.17,62.57 v1(14.16,62.58) ; v1(116.48,55.51) 116.48,55.74 v1(117.11,56.37) 117.76,57.02 122.87,57.02 v2(123.13,57.29) ; 133.39,44.7 133.13,44.96 133.13,45.87 ; R18.1 36.57,13.9 v2(37.14,14.48) ; 83.53,28.79 83.53,28.62 83.77,28.38 v2(83.77,28.09) ; 78.79,28.38 78.53,28.63 78.53,29.75 ; U1.120 83.53,49.87 83.72,49.68 ; v2(72.31,27.86) 72.31,28.36 72.03,28.64 72.03,29.75 ; v1(117.2,58.04) 121.79,58.04 v1(122.18,58.44) 122.24,58.44 v1(124.4,60.59) ; U6.39 14.87,36.47 v1(14.92,36.51) ; v1(8.74,37.77) 8.71,37.8 6.8,37.8 v1(6.78,37.82) ; v1(5.73,36.29) 5.41,35.97 U6.23 ; U4.6 137,49.87 v2(137.13,49.74) 136.76,49.37 135.64,49.37 ; v2(91.66,50.06) 92.18,49.55 92.18,48.86 91.94,48.62 U1.107 ; 78.79,28.37 v2(78.79,27.99) ; 98.29,29.35 98.36,29.28 100.22,29.28 100.52,29.57 ; v1(5.7,37.45) 5.68,37.47 U6.20 ; U6.40 14.54,36.97 v1(14.85,37.28)
  Top Layer w0.203: v1(114.6,49.49) 113.66,50.43 v2(113.66,50.5)
  Top Layer w0.254: 132.14,47.1 132.14,44.38 v2(132.45,44.06) ; U1.107 89.59,48.62 v2(89.59,48.51) ; 133.14,55.49 U4.15 133.14,52.88 ; 61.6,43.58 55.47,43.58 v2(55.4,43.65) ; 61.6,43.58 v2(66.44,43.58) 66.54,43.58 v2(67.47,44.51) ; 61.6,43.58 v2(61.59,43.6) ; v2(73.11,41.92) 73.06,41.96 70.92,41.96 70.58,41.62 U1.16 68.7,41.62 v1(68.29,41.21) ; 83.53,28.79 83.53,30.77 v2(82.98,31.32) ; 92.15,42.23 92.04,42.12 U1.94 89.68,42.12 ; v2(71.34,52.52) 71.57,52.52 72.03,52.06 U1.143 72.03,50 72.22,49.81 ; 81.62,49.75 78.86,49.75 78.53,50.08 78.53,52.11 78.29,52.35 78.29,52.72 ; v1(92.79,46.74) 94.22,48.17 94.22,48.18 94.6,48.56 102.3,48.56 104.77,51.03 113.13,51.03 v2(113.66,50.5) ; v1(93.28,49.93) 93.62,49.6 101.84,49.6 103.73,51.48 v1(103.73,51.71) 103.95,51.71 104.35,52.11 114.38,52.11 v2(114.75,51.74) ; U6.35 10.95,32.38 v1(11.18,32.15) ; v1(14.47,39.95) 13.94,40.48 U6.47 ; 7.94,42.47 7.95,42.47 v1(7.95,43.75) ; v2(92.54,36.95) 92.2,36.62 90.91,36.62 ; v2(125.62,48.87) 128.6,48.87 128.61,48.87 ; v2(66.73,46.23) 66.18,46.79 v2(65.03,46.79) v2(61.58,46.79) 55.46,46.79 v2(55.43,46.75) ; 83.53,51 83.53,52.12 83.44,52.21 ; 78.53,28.67 78.53,30.82 v2(78.23,31.11) ; v2(71.51,35.46) 71.51,34.97 70.66,34.12 U1.31 68.66,34.12 68.55,34.23 66.94,34.23 66.26,33.55
  Top Layer w0.381: 139,49.74 v2(138.97,49.71) ; 139,49.74 v2(137.13,49.74) ; 139,49.74 v1(141.46,49.74) ; v1(4.82,60.33) 4.82,61.54 4.8,61.56
  Top Layer w0.508: 147.05,21.42 145.97,21.42 145.31,20.75 v1(145.31,19.53) ; v1(5.75,67.29) 6.12,67.66 CN6.B1A12 ; CN6.A1B12 12.56,67.81 v1(13.15,67.23) ; 147.05,27.86 145.53,27.86 v2(144.69,28.7) ; 32.43,58.2 v2(32.43,58.2) v2(32.43,60.04) 32.43,61.21 ; U2.2 25.72,61.68 v2(25.52,61.48) 25.04,61 C6.2 C5.2
  Bottom Layer w0.152: v2(96.21,29.61) 97.92,29.61 100.15,31.84 v1(100.88,31.84) ; 72.98,49.75 72.96,49.77 v2(72.43,49.77) ; C11.1 v1(9.42,36.84) ; 113.95,50.18 114.6,49.53 v1(114.6,49.49) ; v1(92.77,27.89) 92.51,28.15 C29.2 ; v2(89.59,48.51) 89.59,47.97 C32.2 ; v1(114.58,29.78) 114.72,29.63 114.72,26.29 v1(114.27,25.84) ; v1(8.74,37.77) 8.75,37.78 C22.1 ; v2(4.7,65.18) TP3.4
  Bottom Layer w0.254: 11.35,38.71 11.35,38.34 11.5,38.19 11.5,37.93 11.32,37.75 11.22,37.75 C11.1 ; 11.35,38.71 12.39,38.71 12.42,38.74 C8.1 ; 11.35,38.71 C9.1 ; 11.35,38.71 v1(10.05,38.71) C22.1 ; C12.1 v1(6.78,37.82) 6.79,37.81 C10.1
  Bottom Layer w0.381: 125.63,51.24 125.63,48.88 v2(125.62,48.87)
  Bottom Layer w0.508: J7.6 109.43,37.23
  vias: v1(57.76,46.76) v1(59.89,37.97) v1(69.8,29.08) v1(69.8,27.48) v1(69.82,22.5) v1(69.77,19) v1(70.99,46.52) v1(70.99,45.41) v1(72.31,22.29) v1(72.77,17.68) v1(76.1,31.67) v1(78.79,23.76) v1(80.06,22.03) v1(83.72,17.12) v1(85.09,31.23) v1(85.91,37.67) v1(92.51,42.26) v1(93.32,42.57) v1(96.84,33.91) v1(99.2,32.19) v1(100.22,29.53) v1(100.6,36.59) v1(100.8,38.12) v1(102.61,31.95) v1(103.71,43.94) v1(104.59,31.95) v1(105.76,30.11) v1(106.04,33.38) v1(106.29,31.95) v1(106.52,29.5) v1(108.62,58.68) v1(108.62,26.19) v1(109.02,30.11) v1(109.25,41.2) v1(109.23,32.04) v1(110.17,26.23) v1(110.17,24.53) v1(110.28,40.17) v1(110.79,45.26) v1(111.12,49.05) v1(112.66,17.11) v1(114.27,21.15) v1(114.53,33.71) v1(114.53,47.34) v1(114.53,45.5) v1(114.53,43.38) v1(114.53,41.26) v1(114.54,35.12) v1(114.58,31.83) v1(114.85,15.26) v1(115.73,23.73) v1(116.08,50.6) v1(116.06,45.51) v1(116.13,38.79) v1(116.35,31.84) v1(116.75,52.23) v1(116.82,26.54) v1(116.74,18.14) v1(117.31,60.51) v1(117.38,46.7) v1(117.48,49.04) v1(117.45,38.79) v1(117.56,50.83) v1(118.92,25.35) v1(118.99,43.43) v1(118.96,41.17) v1(118.97,23.73) v1(120.41,26.54) v1(120.57,15.35) v1(120.91,21.1) v1(120.97,36.08) v1(121.07,18.1) v1(121.27,33.96) v1(121.23,28.73) v1(121.51,55.05) v1(121.5,43.09) v1(121.5,40.07) v1(124.16,25.27) v1(124.16,23.7) v1(124.21,14.61) v1(124.31,33.22) v1(124.29,29.27) v1(124.3,11.87) v1(124.43,20.98) v1(124.64,50.05) v1(125.01,15.93) v1(125.3,53.83) v1(127.69,14.07) v1(127.96,29.86) v1(128.18,33.79) v1(128.15,15.91) v1(128.28,23.76) v1(128.42,10.65) v1(128.72,13.29) v1(129.02,25.79) v1(130.82,19.11) v1(130.75,15.94) v1(131.4,8.45) v1(131.53,23.73) v1(132.68,14.64) v1(133.52,16.31) v1(133.91,25.53) v1(134.44,34.35) v1(134.77,23.68) v1(135.6,28.98) v1(135.87,8.48) v1(136.67,19.11) v1(136.87,25.3) v1(136.87,23.81) v1(137.54,14.67) v1(137.54,11.57) v1(138.91,5.55) v1(138.91,1.13) v1(139.05,34.47) v1(139.13,37.11) v1(139.88,25.85) v1(139.87,23.22) v1(140.07,44.36) v1(142.41,29.53) v1(142.5,15) v1(142.43,11.72) v1(142.43,8.68) v1(143.79,39.9) v1(143.79,38.38) v1(145.65,37.83) v1(146.69,38.89) v1(146.91,18.12) v1(147.64,35.84) v1(148.63,36.91) v1(148.95,25.9) v1(149.12,32) v1(149.4,1.13) v1(150.02,24.49) v1(150.73,32) v1(150.84,27.51) v1(153.91,16.15) v1(153.92,11.49) v1(153.92,7.65) v2(0.89,46.48) v2(0.89,43.48) v2(0.89,40.48) v2(0.89,28.7) v2(0.89,25.7) v2(0.89,22.7) v2(1.4,66.29) v2(1.4,63.29) v2(1.4,60.29) v2(1.4,10.72) v2(1.4,7.72) v2(1.45,5.49) v2(1.45,3.45) v2(1.45,1.6) v2(3.38,75.38) v2(3.38,69.38) v2(3.38,9.38) v2(3.38,6.38) v2(3.72,72.2) v2(3.81,34.42) v2(3.94,48.51) v2(3.94,45.51) v2(3.94,42.51) v2(4.06,17.27) v2(4.06,15.49) v2(4.32,32.23) v2(4.44,26.72) v2(4.57,67.31) v2(5.21,30.1) v2(6.1,5.97) v2(6.38,60.38) v2(6.38,51.38) v2(6.38,48.38) v2(7.02,53.72) v2(7.37,59.69) v2(7.37,56.69) v2(8.62,36.26) v2(9.38,60.38) v2(9.38,57.38) v2(9.38,54.38) v2(9.38,30.38) v2(9.38,27.38) v2(10.16,21.21) v2(10.29,17.27) v2(10.26,11.3) v2(10.69,8.31) v2(11.22,30.39) v2(11.3,27.94) v2(11.49,7.66) v2(11.81,17.27) v2(12,10) v2(12.06,21.21) v2(12.38,60.38) v2(12.38,42.38) v2(12.34,11.48) v2(12.33,9.44) v2(12.78,32.88) v2(13.06,11.48) v2(13.06,9.45) v2(13.06,8.66) v2(13.21,17.4) v2(13.21,5.87) v2(13.33,43.16) v2(13.56,34.56) v2(13.72,19.94) v2(13.84,30.1) v2(14.22,42.39) v2(15.38,75.38) v2(15.38,72.38) v2(15.38,69.38) v2(17.4,61.59) v2(17.4,58.59) v2(17.4,55.59) v2(17.64,51.56) v2(17.65,48.91) v2(17.65,45.69) v2(17.67,37.57) v2(17.65,34.29) v2(17.65,31.29) v2(17.65,27.81) v2(17.65,24.81) v2(17.65,21.81) v2(17.68,5.87) v2(17.65,2.29) v2(17.78,17.4) v2(17.78,16.26) v2(17.73,11.58) v2(20.57,12.7) v2(20.57,9.7) v2(20.57,6.7) v2(21.38,75.38) v2(21.38,69.38) v2(21.38,66.38) v2(22.23,64.19) v2(22.86,59.56) v2(22.91,58.04) v2(23,52.77) v2(23.11,48.01) v2(24.3,43.64) v2(24.38,75.38) v2(24.38,69.38) v2(24.38,66.38) v2(24.38,54.38) v2(24.38,6.38) v2(25.62,42.19) v2(25.58,16.21) v2(25.78,64.39) v2(25.73,59.56) v2(25.78,58.04) v2(25.91,23.5) v2(25.91,21.72) v2(25.91,17.65) v2(25.95,25.88) v2(26.39,14.05) v2(27.38,75.38) v2(27.38,72.38) v2(27.38,66.38) v2(27.38,54.38) v2(27.38,12.38) v2(27.41,9.68) v2(27.38,6.38) v2(27.38,3.38) v2(27.89,15.38) v2(27.91,14.05) v2(28.14,17.68) v2(28.32,26.42) v2(28.34,59.7) v2(28.4,58.04) v2(28.73,64.38) v2(29.72,61.72) v2(29.88,27.26) v2(29.97,39.88) v2(30.38,75.38) v2(30.38,72.38) v2(30.38,69.38) v2(30.38,66.38) v2(30.38,54.38) v2(30.38,51.38) v2(30.38,21.38) v2(30.38,15.38) v2(30.38,6.38) v2(30.64,29.75) v2(30.73,32.51) v2(31.02,24.64) v2(32.38,55.37) v2(32.51,53.21) v2(32.77,34.8) v2(32.73,32.16) v2(33.23,72.58) v2(33.38,75.38) v2(33.38,66.38) v2(33.38,21.38) v2(33.38,12.38) v2(33.38,6.38) v2(33.38,3.38) v2(33.49,48.38) v2(33.52,45.36) v2(34.14,11.02) v2(35.18,34.92) v2(35.18,31.92) v2(35.18,28.92) v2(35.69,12.72) v2(35.81,63.75) v2(35.81,60.56) v2(35.81,58.67) v2(36.21,49.88) v2(36.32,38.23) v2(36.38,42.38) v2(36.38,36.38) v2(36.38,33.38) v2(36.38,30.38) v2(36.38,27.38) v2(36.38,21.38) v2(36.38,3.38) v2(37.08,16) v2(38.04,60.97) v2(38.06,58.84) v2(38.15,63.92) v2(38.24,55.2) v2(38.35,27.56) v2(38.76,15.98) v2(39.38,3.38) v2(39.73,49.88) v2(39.77,39.7) v2(39.88,22.48) v2(40.26,27.31) v2(41.81,46.79) v2(43.1,49.05) v2(43.51,76.03) v2(43.61,0.89) v2(44.25,41.68) v2(45.85,43.74) v2(46.51,76.03) v2(46.61,0.89) v2(48.21,45.31) v2(48.45,18.49) v2(48.72,15.21) v2(48.91,46.67) v2(48.93,43.8) v2(49.51,76.03) v2(49.61,0.89) v2(50.11,13.74) v2(50.67,22.35) v2(50.83,45.28) v2(51.38,36.38) v2(51.38,33.38) v2(51.38,30.38) v2(51.38,27.38) v2(51.45,18.49) v2(51.45,15.49) v2(51.46,12.47) v2(51.95,46.7) v2(51.93,43.81) v2(53.11,22.12) v2(53.36,45.22) v2(53.61,36.04) v2(54.23,33.34) v2(54.38,30.38) v2(54.38,27.38) v2(54.38,3.38) v2(54.45,18.49) v2(54.87,73.86) v2(55.94,22.13) v2(56.11,37.86) v2(56.19,35.8) v2(56.14,33.24) v2(57.38,30.38) v2(57.38,27.38) v2(57.38,3.38) v2(57.45,15.49) v2(57.45,12.49) v2(57.55,43.6) v2(57.87,73.86) v2(58.18,22.14) v2(59.73,22.16) v2(60.38,3.38) v2(60.45,18.49) v2(60.87,73.86) v2(61.85,22.07) v2(62.42,30.23) v2(62.73,33.35) v2(62.86,27.4) v2(63.09,22.12) v2(63.38,3.38) v2(64.13,37.84) v2(65.21,76) v2(66.21,33.4) v2(66.38,3.38) v2(68.21,76) v2(68.62,60.43) v2(69.38,3.38) v2(71.21,76) v2(71.13,33.03) v2(71.53,0.89) v2(72.29,25.77) v2(72.38,3.38) v2(73.1,45.42) v2(73.1,43.68) v2(73.12,39.73) v2(73.25,34.93) v2(73.51,33.65) v2(74.53,0.89) v2(75.64,46.94) v2(75.7,33.66) v2(75.73,42.38) v2(75.81,35.2) v2(75.96,49.72) v2(76.54,3.3) v2(77.01,49.73) v2(77.53,0.89) v2(77.71,33.62) v2(78,46.91) v2(78.33,52.68) v2(78.33,44.62) v2(78.38,42.38) v2(78.42,40.21) v2(78.34,35.22) v2(78.84,25.78) v2(79.72,3.28) v2(80.19,31.33) v2(80.41,73.86) v2(80.47,46.91) v2(80.45,33.66) v2(80.58,35.16) v2(80.65,44.35) v2(82.07,49.76) v2(82.42,46.91) v2(82.48,35.2) v2(82.8,33.66) v2(83,44.48) v2(83.21,53.11) v2(83.26,52.38) v2(83.41,73.86) v2(83.54,3.3) v2(83.68,40.9) v2(83.77,46.94) v2(83.8,25.79) v2(83.94,35.2) v2(86,44.85) v2(86.07,41.99) v2(86.41,73.86) v2(86.77,49.83) v2(87.39,46.75) v2(87.38,42.38) v2(87.46,35.05) v2(87.77,32.04) v2(87.83,45.59) v2(89.51,46.34) v2(89.51,45.18) v2(89.51,41.49) v2(89.46,39.65) v2(89.51,34.5) v2(89.58,32.43) v2(90.05,49.94) v2(90.79,50.69) v2(91.9,31.02) v2(91.94,29.64) v2(93.71,31.02) v2(93.84,29.63) v2(94.63,76.04) v2(96.38,3.38) v2(96.48,31) v2(97.63,76.04) v2(99.38,3.38) v2(99.81,65.77) v2(100.63,76.04) v2(102.38,3.38) v2(102.61,33.46) v2(103.87,48.19) v2(104.03,45.44) v2(105.38,3.38) v2(105.44,73.86) v2(107.2,0.91) v2(108.44,73.86) v2(108.85,43.75) v2(109.55,33.49) v2(110.2,0.91) v2(111.38,63.38) v2(111.38,60.38) v2(111.44,73.86) v2(113.2,0.91) v2(114.02,55.38) v2(114.38,72.38) v2(114.38,63.38) v2(114.38,60.38) v2(114.38,3.38) v2(114.98,56.3) v2(116.09,47.8) v2(116.08,43.42) v2(116.12,41.18) v2(116.1,35.38) v2(116.32,29.57) v2(117.38,72.38) v2(117.38,41.18) v2(117.34,33.59) v2(117.38,3.38) v2(117.44,43.42) v2(118.87,35.03) v2(118.98,31.99) v2(120.38,72.38) v2(120.38,3.38) v2(121.53,61.18) v2(122.09,47.8) v2(123.21,72.3) v2(123.47,63.12) v2(123.89,42.94) v2(123.86,40.94) v2(124.18,37.96) v2(124.42,57.3) v2(124.49,58.72) v2(126.27,63.87) v2(126.38,75.38) v2(126.38,69.38) v2(126.38,66.38) v2(126.35,46.42) v2(127.4,55.42) v2(127.57,46.29) v2(127.68,56.96) v2(127.82,54.22) v2(128.09,38.8) v2(128.24,37.09) v2(128.74,66.6) v2(128.84,48.82) v2(129.12,47.75) v2(129.12,43.68) v2(129.38,75.38) v2(129.38,69.38) v2(130.22,65.23) v2(130.61,53.22) v2(130.99,43.51) v2(131.38,36.81) v2(131.6,51.3) v2(131.59,49.4) v2(131.72,63.55) v2(131.85,66.87) v2(131.91,52.63) v2(132.05,42.32) v2(132.73,55.93) v2(133.25,51.54) v2(133.39,49.33) v2(133.4,47.27) v2(133.48,44.04) v2(134.09,41.8) v2(134.09,38.8) v2(134.56,69.85) v2(134.83,75.86) v2(134.89,53.94) v2(134.99,71.77) v2(134.93,55.16) v2(135.29,46.33) v2(136.45,54.51) v2(137.08,53.42) v2(137.09,44.8) v2(137.09,41.8) v2(137.69,54.51) v2(138.3,45.79) v2(139.04,54.51) v2(140.69,53.72) v2(141.35,54.53) v2(141.35,52.58) v2(141.35,51.61) v2(142.3,53.63) v2(142.55,47.68) v2(143.18,54.47) v2(145.16,48.47) v2(145.49,54.03) v2(147.29,54.56) v2(148.86,49.22) v2(150.5,54.51) v2(151.66,54.51) v2(152,49.24) v2(152.09,50.8) v2(154.2,54.36) v2(154.2,52.73) v2(154.18,51.11)
VBAT: length 69.1
  Top Layer w0.152: 46.8,46.52 48.05,47.77 66.99,47.77 68.11,46.64 68.14,46.62 U1.6
  Top Layer w0.254: 68.11,46.64 U1.6
  Bottom Layer w0.152: J2.6 40.63,9.41 43.15,11.92 43.15,42.86 46.8,46.52 ; 69.23,47.62 69.22,47.63 C35.1
  Bottom Layer w0.254: 68.11,46.64 68.11,47.32 67.79,47.63 69.23,47.62
  vias: v1(46.8,46.52) v1(68.11,46.64)
VBUS: length 17.2
  Top Layer w0.152: R34.2 144.04,27.69 v3(144.61,27.12)
  Top Layer w0.508: D2.2 142.5,20.38 v3(143.62,20.38) 145.43,22.19 147.05,22.19 ; v3(144.61,27.12) 144.64,27.09 147.05,27.09
  Bottom Layer w0.508: v3(143.62,20.38) 143.62,26.13 v3(144.61,27.12)
VCC: length 63.2
  Top Layer w0.254: v1(5.73,35.46) 5.72,35.47 4.44,35.47 ; P1.1 12.93,31.48 11.44,32.97 11.44,33.97 ; v1(11.44,35.16) 11.45,35.16 U6.36 ; 12.95,40.97 11.96,40.97 11.95,40.97 v1(11.45,40.97) 11.45,41.44 11.44,41.45 11.44,42.47 ; v1(15.02,54.68) 14.04,53.71 12.2,53.71 9.14,50.64 RP1.1 RP1.2 9.14,47.51 ; v1(7.42,41.43) 7.45,41.46 U6.9
  Top Layer w0.508: v1(15.02,54.68) 14.98,54.72 C14.2 15.11,55.92 U7.5
  Bottom Layer w0.152: C10.2 6.84,35.51
  Bottom Layer w0.254: C10.2 6.18,35.51 6.13,35.46 v1(5.73,35.46) ; 6.84,35.51 7.78,35.51 ; 7.78,35.51 7.77,35.52 7.77,39.17 6.83,40.11 C12.2 6.78,40.79 v1(7.42,41.43) 10.31,41.43 10.77,40.97 v1(11.45,40.97) ; 7.78,35.51 9.4,35.51 9.41,35.52 10.22,35.52 C11.2 11.16,35.44 v1(11.44,35.16)
  Bottom Layer w0.381: v1(11.45,40.97) 11.45,40.22 11.35,40.12 13.11,40.12 C8.2 13.24,40.14 16.1,43 J9.1
  Bottom Layer w0.508: J9.1 16.51,43.26 16.51,53.19 v1(15.02,54.68)
VCC3.5V: length 5.5
  Top Layer w0.508: D5.2 U5.5
VDD: length 461.1
  Top Layer w0.152: 90.91,37.12 88.66,37.12 v1(88.64,37.14) ; 83.03,50.99 83.03,50.99 v1(83.03,49.67) ; 84.01,31.07 84.03,31.06 84.03,29.75 ; 78.02,49.77 78.02,50.98 78.03,50.99
  Top Layer w0.254: 78.02,49.77 78.03,50.99 ; 83.03,50.99 v1(83.03,49.67) ; U1.95 v1(88.64,42.62) ; 89.03,29.75 89.03,28.46 v1(89.29,28.2) ; 79.03,29.75 79.03,30.94 v1(79.11,31.02) ; B2.3 B2.1 31.62,10.2 v1(32.38,10.96) ; 72.53,29.75 72.53,31.1 ; 84.03,29.75 84.01,31.07 ; U1.108 89.29,49.12 v1(88.87,48.7) ; U1.144 71.53,51.51 71.14,51.9 v1(69.99,51.9) ; 90.9,37.12 U1.84 ; U1.17 70.93,41.12
  Top Layer w0.508: 35.2,52.03 32.76,52.03 30.28,49.55 30.28,45.45 ; 35.2,52.03 35.72,52.57 ; 35.2,52.03 36.26,52.03 ; 30.28,45.45 30.33,45.45 v1(34.18,41.6) ; 30.28,45.45 JP1.1 ; 79.22,48.04 72.04,48.04 v1(72.04,48.03) ; 35.72,52.57 36.26,52.03 ; 35.72,52.57 35.72,54.52 36.39,54.52 36.84,54.97 36.84,56.75 ; 36.26,52.03 66.39,52.03 ; J2.17 58.13,4.5 82.69,4.5 83.81,5.62 J2.39 ; J1.72 36.85,66.4 JP3.2 ; v1(79.21,48.04) v1(84.27,48.04) 85.93,48.04 86.21,47.76 v2(87.84,47.76)
  Bottom Layer w0.152: 88.61,47.73 88.61,47.55 ; 78.02,49.77 78.04,49.74
  Bottom Layer w0.254: J1.12 112.97,68.91 112.97,71.71 ; v1(89.29,28.2) 90.24,28.2 C29.1 ; J1.36 82.54,68.96 82.54,72.74 ; 69.23,46.22 69.3,46.22 70.93,44.59 70.93,41.12 ; 100.32,4.33 100.32,8.04 J2.52 ; 88.95,38.36 88.72,38.36 C30.1 ; 113.02,4.33 113.02,8.04 J2.62 ; 79.28,49.74 78.02,49.74 ; v1(83.03,49.67) 83.07,49.72 C33.1 ; J2.72 123.21,8.06 123.21,4.56 122.98,4.33 ; v1(70.94,41.12) 70.94,40.59 C25.1 ; 50.85,72.74 50.79,72.68 J1.59 ; C24.1 69.85,52.04 v1(69.99,51.9) ; J1.49 63.57,70.31 63.57,72.74 ; 88.63,47.76 88.63,48.47 v1(88.87,48.7)
  Bottom Layer w0.381: 81.93,32.23 83.79,32.23 83.79,31.3 84.02,31.07 ; 81.93,32.23 81.51,32.65 ; 81.93,32.23 81.1,32.23 ; 70.41,32.25 70.41,30.95 L1.1 ; 70.41,32.25 72.53,32.25 72.53,31.12 73.51,30.15 76.03,30.15 78.08,32.2 79.09,32.2 ; 70.41,32.25 70.42,32.26 L2.1 70.42,40.07 ; 81.51,32.65 v1(81.51,48.02) ; 81.51,32.65 81.1,32.23 ; 79.28,49.74 79.28,48.04 79.22,48.04 ; 79.11,32.18 v1(79.11,31.02) ; v1(84.27,48.04) 84.33,48.1 C33.1 ; 81.1,32.23 79.09,32.23 ; C29.1 90.29,30.64 88.61,32.32 88.61,36.93 ; 88.66,37.14 C30.1 88.66,47.55
  Bottom Layer w0.508: 96.51,72.74 34.8,72.74 33.63,71.57 33.63,69.62 J1.72 ; 96.51,72.74 J1.23 ; 96.51,72.74 111.94,72.74 112.97,71.71 ; v1(34.18,41.6) 34.18,19.21 32.4,17.43 32.4,5.98 34.05,4.33 53.43,4.33 J2.17 ; 122.98,4.33 84.72,4.33 83.86,5.19 83.86,6.72 J2.39 ; v1(72.04,48.03) 68.93,51.14 C24.1 68.92,52.03 v1(66.39,52.03) ; v2(87.84,47.76) 88.61,47.76
  vias: v1(72.53,31.1) v1(78.02,49.77) v1(84.01,31.07)
VDDA: length 40.4
  Top Layer w0.152: J2.33 74.95,8.01 74.95,10.15 72.89,12.2 68.32,12.2 66.51,14.01 66.51,32.09 67.55,33.12 U1.33
  Bottom Layer w0.152: 67.54,32.11 67.54,33.09 67.53,33.11 ; 68.92,30.79 68.97,30.84
  Bottom Layer w0.508: 67.53,33.11 67.54,32.11 67.54,30.79 68.92,30.79 ; 68.97,30.84 68.92,30.79
  vias: v1(67.53,33.11)
ATLINK_5V: length 85.4
  Top Layer w0.508: F2.1 11,65.4 v1(11,66.26) ; 6.9,66.26 6.89,66.28 CN6.B4A9 ; CN6.A4B9 11.8,69 v1(11.8,66.31)
  Bottom Layer w0.381: TP3.1 12.32,65.79 v1(11.8,66.31)
  Bottom Layer w0.762: D3.2 16.21,12.73 15.44,13.49 4.54,13.49 2.86,15.17 2.86,65.24 3.91,66.29 v1(6.53,66.29) v1(7.21,66.29) 10.97,66.29 v1(11,66.26) 11.76,66.26 v1(11.8,66.31)
ATLK_BOOT0: length 10.1
  Top Layer w0.152: 6.94,33.97 6.94,25.35 7.34,24.96 7.34,24.08
ATLK_NRST: length 10.6
  Top Layer w0.152: 7.44,33.97 7.44,26.64 9.22,24.87 9.22,24.06
ATLK_RX: length 57.9
  Top Layer w0.152: 13.06,22.66 13.06,20.53 12.52,20 v1(12.52,14.7) 12.59,14.63 ; v1(7.38,14.7) 7.37,14.69 v1(7.37,9.8)
  Bottom Layer w0.152: 28.74,28.64 28.87,28.51 29.99,28.51 ; 28.03,28.64 27.38,27.98 27.38,16.21 24.99,13.82 16.51,13.82 15.63,14.7 v1(12.52,14.7) v1(7.38,14.7) ; CN7.10 5.5,2.96 5.5,7.92 v1(7.37,9.8)
ATLK_SWCLK: length 10.8
  Top Layer w0.152: 3.58,24.1 3.58,24.85 5.95,27.22 U6.25
ATLK_SWDIO: length 10.3
  Top Layer w0.152: 5.46,24.1 5.46,25.21 6.45,26.2 U6.26
ATLK_SWO: length 13.5
  Top Layer w0.152: 3.57,29.01 3.57,30.94 2.87,31.64 2.87,40.36 3.48,40.97 4.44,40.97
ATLK_TX: length 57.1
  Top Layer w0.152: v1(9.47,8.83) 11.12,10.48 v1(11.12,15.31) 11.12,21.49 11.13,21.49 11.13,22.66
  Bottom Layer w0.152: CN4.8 29.19,31.17 29.25,31.23 30,31.23 ; 28.03,31.17 26.81,29.95 26.81,16.41 24.66,14.26 16.83,14.26 15.76,15.33 11.14,15.33 v1(11.12,15.31) ; v1(9.47,8.83) 7.99,7.34 7.99,2.91 6.75,1.68
BOOT0: length 144.8
  Top Layer w0.152: 7.34,22.66 7.34,21.48 8.24,20.58 8.24,9.02 11.4,5.87 12.05,5.87 13.12,4.8 13.12,2.96 CN7.4 ; v1(24.96,26.35) 25.61,26.35 26.87,27.61 26.87,35.09 28.03,36.25 ; 43.17,67.68 43.17,57.57 v1(45.58,55.15) 72.63,55.15 74.53,53.25 74.53,50.99 ; v1(30.08,41.3) v1(31.88,41.3)
  Bottom Layer w0.152: v1(45.58,55.15) 43.88,53.45 35.29,53.45 31.84,50 31.84,38.23 29.88,36.26 CN4.4 ; v1(30.08,41.3) 29.04,41.3 29.01,41.33 ; v1(8.25,15.88) 15.87,15.88 17.11,14.64 23.91,14.64 24.96,15.69 v1(24.96,26.35)
CAN1_RX: length 108.7
  Top Layer w0.152: v1(86.53,54.37) 86.94,54.78 v2(111.51,54.78) ; v1(114.84,16.19) 114.98,16.06 123.82,16.06 128.32,11.56 R90.1 ; 86.53,50.99 86.53,51 86.53,54.37
  Bottom Layer w0.152: J1.42 73.65,65.95 74.54,65.06 78.55,65.06 79.57,64.04 80.38,64.04 81.09,63.33 81.09,61.06 82.06,60.1 84.07,60.1 86.53,57.64 86.53,54.37 ; v1(114.84,16.19) 111.92,19.12 111.92,43.16 112.1,43.34 112.1,54.19 v2(111.51,54.78)
CAN1_STB: length 154.8
  Top Layer w0.152: v1(112.02,57.28) 111.99,57.32 106.08,57.32 105.26,58.14 103.49,58.14 103.21,57.86 85.48,57.86 84.7,58.65 v1(83.5,58.65) ; J1.65 44.47,68.93 44.47,57.69 46.65,55.51 72.99,55.51 v1(75.01,53.49) 75.03,53.47 75.03,50.99 ; v1(115.63,17.32) 115.94,17 136.95,17 138.59,15.37 U9.8
  Bottom Layer w0.152: v1(75.01,53.49) 76.38,53.49 81.54,58.65 v1(83.5,58.65) ; v1(115.63,17.32) 113.01,19.94 113.01,56.3 v1(112.02,57.28)
CAN1_TX: length 116
  Top Layer w0.152: v1(114.81,17.06) 115.37,16.5 132.04,16.5 133.18,15.37 U9.1 ; v1(86.03,54.95) 86.33,55.26 111.91,55.26 v1(112.25,54.92) ; 86.03,54.95 86.03,51 86.03,50.99
  Bottom Layer w0.152: v1(112.25,54.92) 112.45,54.72 112.45,19.43 v1(114.81,17.06) ; 86.03,54.95 86.03,57.61 83.98,59.65 81.88,59.65 80.42,61.11 79.61,61.11 78.91,61.81 78.91,63.89 78.15,64.65 73.37,64.65 72.36,65.67 72.36,68.99 J1.43
CAN_H: length 17.6
  Top Layer w0.254: 140.31,14.1 v1(143.64,14.1) 144.04,13.69 144.04,8.36 v1(144.4,8)
  Bottom Layer w0.254: v1(144.4,8) 144.4,6.74 R89.2 ; 148.23,14.36 148.23,13.11 147.83,12.7 146.43,12.7 145.1,14.03 D6.1 143.7,14.03 v1(143.64,14.1)
CAN_L: length 18.9
  Top Layer w0.254: U9.6 142.81,12.83 v1(143.51,12.13) 143.51,7.35 143.15,7 SW1.1
  Bottom Layer w0.254: v1(143.51,12.13) D6.2 147.63,12.13 148.23,11.53 CN8.1
CC1: length 2.6
  Top Layer w0.152: CN6.A5 10.59,70.44 v2(10.57,70.46)
  Bottom Layer w0.152: v2(10.57,70.46) R86.1
CC2: length 2.7
  Top Layer w0.152: v2(7.57,70.41) 7.59,70.39 CN6.B5
  Bottom Layer w0.152: v2(7.57,70.41) 7.57,71.08 7.62,71.13 R87.1
CRS_DV: length 6.1
  Top Layer w0.152: 128.64,45.87 128.64,45.38 128.09,44.84 125.35,44.84 124.38,45.81 123.67,45.81
EGND: length 20.8
  Top Layer w0.508: CN6.13 CN6.15 CN6.16 CN6.14
  Bottom Layer w0.508: CN6.13 13.66,68.32 C20.2 15.59,67.76 R88.1
EGND1: length 42.4
  Top Layer w0.508: CN2.15 CN2.13
  Bottom Layer w0.508: CN1.SH2 144.8,31.41 147.24,28.96 CN2.14 CN2.16 CN2.15 ; CN1.SH2 140.2,32.25 R35.2 140.15,30.54 C21.1 ; CN1.SH2 CN1.SH1
EMAC_GND: length 33.5
  Top Layer w0.508: 152.49,62.89 152.71,62.67 C49.2 ; 140.3,57.05 138.36,57.05 137,58.4 137,62.89 152.49,62.89
EMAC_NRST: length 7.5
  Top Layer w0.152: 130.13,45.87 130.13,44.96 129.54,44.37 123.98,44.37 123.83,44.51
LD1: length 19.3
  Top Layer w0.152: U6.10 6.95,43.88 7.48,44.41 9.41,44.41 9.81,44 14.48,44 v1(15.21,44.73) ; v1(15.47,52.15) 15.44,52.12 LD1.2
  Bottom Layer w0.152: v1(15.21,44.73) 15.26,44.73 15.98,45.46 15.98,51.64 v1(15.47,52.15)
LD2: length 16.4
  Top Layer w0.152: v1(15.41,49.26) 15.41,49.35 14.52,50.24 ; U6.11 6.45,44.08 7.29,44.93 9.71,44.93 10.07,44.57 v1(14.12,44.57)
  Bottom Layer w0.152: v1(15.41,49.26) 15.41,45.86 v1(14.12,44.57)
LD3: length 13.3
  Top Layer w0.152: LD3.2 13.69,47.45 v1(13.68,47.45) ; U6.12 5.95,44.29 7.05,45.39 10.35,45.39 10.66,45.09 v1(11.52,45.09)
  Bottom Layer w0.152: v1(13.68,47.45) 13.68,45.71 13.06,45.09 v1(11.52,45.09)
LD4: length 17.9
  Top Layer w0.152: 14.52,46.36 14.52,46.31 13.59,45.38 12.29,45.38 11.89,45.79 6.79,45.79 5.38,44.39 5.38,41.59 5.68,41.3 5.68,38.22 5.43,37.97 U6.19
LED_G: length 6.1
  Top Layer w0.254: 134.23,58.37 134.23,56.88 135.64,55.48 135.64,52.87
LED_Y: length 4.6
  Top Layer w0.254: 132.76,58.37 132.76,57.03 134.13,55.65 134.13,54.37
M-ATLK_RX: length 12.3
  Top Layer w0.152: 12.98,24.03 12.98,24.86 8.12,29.71 8.12,31.47 8.95,32.29 U6.31
M-ATLK_TX: length 11.6
  Top Layer w0.152: U6.30 8.45,32.4 7.75,31.71 7.75,28 11.1,24.65 11.1,24.03
M-BOOT0: length 3.9
  Top Layer w0.152: 12.95,38.97 14.76,38.97 16.25,40.46
M-NRST: length 22.7
  Top Layer w0.152: 8.45,42.47 8.45,41.12 v1(8.7,40.86) ; v1(10.04,40.09) 10.78,40.09 11.5,39.37 v1(11.5,36.17)
  Bottom Layer w0.152: C22.2 10.02,40.11 v1(10.04,40.09) ; v1(11.5,36.17) 12.19,35.48 12.19,27.13 P1.4
  Bottom Layer w0.254: C22.2 8.75,40.82 v1(8.7,40.86)
M-SWCLK: length 12.1
  Top Layer w0.152: U6.37 14.1,35.47 v1(14.6,34.97)
  Bottom Layer w0.152: P1.3 13.05,28.82 13.05,32.29 14.6,33.84 v1(14.6,34.97)
M-SWDIO: length 9.6
  Top Layer w0.152: 10.44,33.97 10.44,29.77 11.27,28.94 P1.2
M-USB_DM: length 39.6
  Top Layer w0.152: 9.17,31.59 9.45,31.86 U6.32 ; R12.2 9.16,61.77 v1(9.14,61.75)
  Bottom Layer w0.152: v1(9.14,61.75) 8.66,61.27 8.66,52.34 4.91,48.59 4.91,33.55 7.08,31.38 8.96,31.38 v1(9.17,31.58)
M-USB_DP: length 40.9
  Top Layer w0.152: v1(7.88,61.74) 7.84,61.78 R11.2 ; U6.33 9.95,31.5 9.85,31.41
  Bottom Layer w0.152: v1(7.88,61.74) 8.35,61.26 8.35,52.47 4.6,48.72 4.6,33.42 6.95,31.07 9.52,31.07 v1(9.85,31.4)
MDINTR: length 3.5
  Top Layer w0.152: R83.2 124.75,49.1 125.02,49.37 U4.32
MDIO: length 4.9
  Top Layer w0.152: R63.2 v1(124.44,53.22) 124.79,52.87 127.13,52.87
  Bottom Layer w0.152: v1(124.44,53.22) 123.72,53.94 R72.1
NRST: length 178
  Top Layer w0.152: 63.81,20.25 63.76,20.2 63.76,20.18 42.03,20.18 39.77,17.92 C40.1 34.76,18.75 31.89,18.75 31.62,18.48 22.82,18.48 22.82,17.11 20.55,14.83 17.86,14.83 v1(17.44,15.25) ; 63.81,20.25 63.81,34.63 66.3,37.12 86.19,37.12 87.97,35.34 v1(89.45,35.34) ; 63.81,20.25 63.81,11.23 64.79,10.24 64.79,8.01 J2.25 ; 9.22,16.82 9.23,16.83 9.23,9.74 v1(9.22,9.73) ; 9.22,16.82 v2(9.22,16.37) ; 9.22,16.82 9.22,22.66 ; v1(93.38,36.75) 93.86,37.23 J7.5
  Bottom Layer w0.152: CN4.7 24.12,29.8 v1(24.12,18.47) ; v2(9.22,16.37) 16.32,16.37 v1(17.44,15.25) ; v1(93.38,36.75) 91.97,35.34 v1(89.45,35.34) ; J2.25 67.3,8.04 67.3,10.68 68.52,11.9 72.99,11.9 73.92,12.82 73.92,14.36 ; v1(9.22,9.73) 6.75,7.26 6.75,4.22
OTGFS1_D+: length 30.6
  Top Layer w0.152: v1(145.29,24.39) 148.9,24.39 150.19,25.68 150.19,34.52 145.34,39.37 142.97,39.37 CN1.3 ; R30.2 142.57,25.03 v1(144.34,25.03) 144.7,25.39 147.05,25.39
  Bottom Layer w0.152: v1(145.29,24.39) 144.98,24.39 v1(144.34,25.03)
OTGFS1_D-: length 29.6
  Top Layer w0.152: 144.7,23.89 144.69,23.9 144.69,24.6 144.99,24.89 148.97,24.89 149.88,25.81 149.88,34.39 145.29,38.99 142.82,38.99 CN1.2 ; 144.7,23.89 143.78,23.89 143.59,23.7 R31.2 ; 144.7,23.89 147.05,23.89
PA0: length 81.7
  Top Layer w0.152: J2.34 76.19,9.97 73.5,12.66 70.81,12.66 70.17,13.29 70.17,15.66 67.4,18.42 67.4,21.97 66.87,22.5 66.87,31.84 67.65,32.62 U1.34 ; 35.64,16.6 36.64,16.6 37.14,17.1 40.01,17.1 42.46,19.54 v1(62.52,19.54)
  Bottom Layer w0.152: J2.34 79.47,12.58 88.31,12.58 90.09,14.36 91.7,14.36 ; v1(62.52,19.54) v1(67.4,19.54)
PA1: length 93.3
  Top Layer w0.152: RP3.4 128.79,60.9 128.54,61.15 125.69,61.15 122,57.45 117.03,57.45 116.23,56.65 ; v1(116.74,34.77) 114.67,32.7 100.48,32.7 98.21,30.43 90.68,30.43 86.85,34.26 73.24,34.26 71.1,32.12 U1.35 68.18,32.12 67.69,31.63 R84.2
  Bottom Layer w0.152: v1(116.74,34.77) 116.74,51.11 115.62,52.23 115.62,56.04 v1(116.23,56.65)
